# Altium project Front_LED_Module.PrjPcb
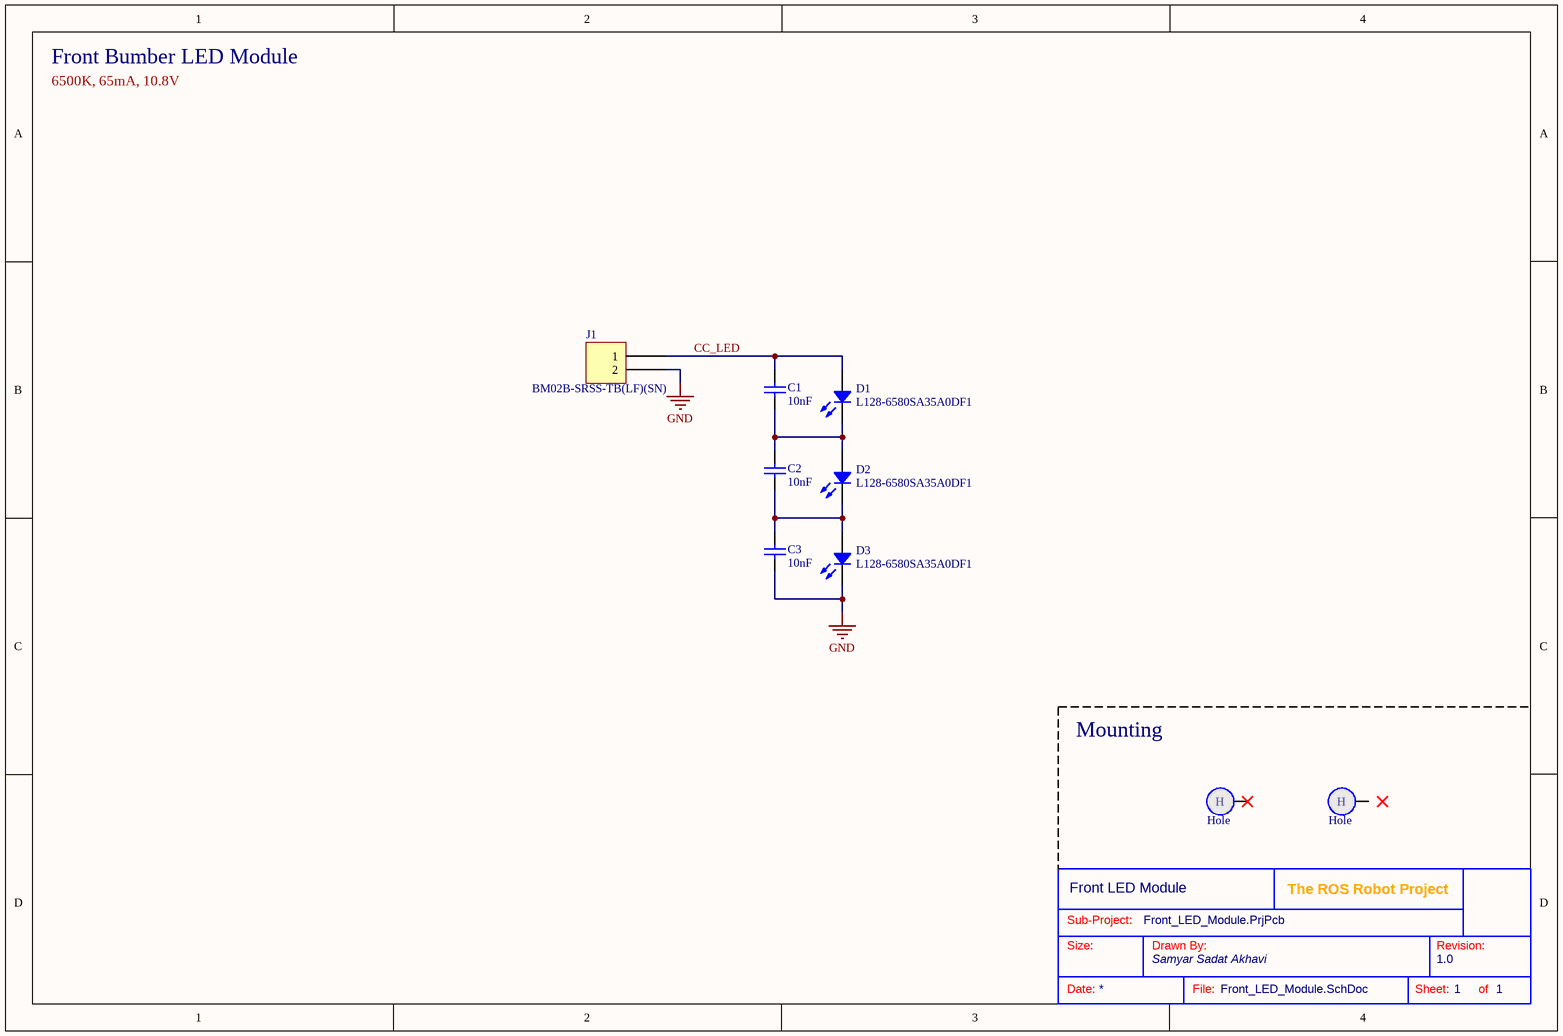
[diagram p0: Front_LED_Module.SchDoc]
MainProjectName: The ROS Robot Project
1 sheet, 10 parts. Net scope: global (net labels, ports and power ports of the same name join across sheets).
Board file: Front_LED_Module.PcbDoc

## Sheet Front_LED_Module.SchDoc: Front LED Module
size A4; DrawnBy: Samyar Sadat Akhavi; Revision: 1.0; SheetNumber: 1; SheetTotal: 1

### Parts
?  (no value)  (graphical)
C1  10nF  [CAP_SMD_603]
C2  10nF  [CAP_SMD_603]
C3  10nF  [CAP_SMD_603]
D1  L128-6580SA35A0DF1  [CREE J 2835]
D2  L128-6580SA35A0DF1  [CREE J 2835]
D3  L128-6580SA35A0DF1  [CREE J 2835]
Hole1  Hole  [Hole_2mm]  (no BOM)
Hole2  Hole  [Hole_2mm]  (no BOM)
J1  BM02B-SRSS-TB(LF)(SN)  [JST BM02B-SRSS-TB]

### Nets
GND: C3.2 D3.2 J1.2
CC_LED: C1.1 D1.1 J1.1
NetC1_2: C1.2 C2.1 D1.2 D2.1
NetC2_2: C2.2 C3.1 D2.2 D3.1

Not connected (* = marked no-connect by the designer): Hole1 1*; Hole2 1

### Notes on the sheet
- Front Bumber LED Module
- 6500K, 65mA, 10.8V
- Mounting
- Sub-Project:
- Size:
- Drawn By:
- Revision:
- Date:
- File:
- Sheet:
- of
- (in symbol Hole) H

### Library data of the parts
? = Standard Title Block
C1-C3 = Non-polar Capacitor: Generic Ceramic Capacitor; Voltage: 16V; Value: 10nF
D1-D3 = JE2835AWT-R-H40GA0000-N0000001: LED COOL WHITE 6500K LUXEON 2835 2.7V; Part Number: L128-6580SA35A0DF1
J1 = BM02B-SRSS-TB(LF)(SN): CONN HEADER SMD 2POS 1MM; Manufacturer: JST Sales America Inc.; Current Rating (Amps): 0.7A; Material Flammability Rating: UL94 V-0; Number of Positions: 2; Number of Positions Loaded: All; Pitch - Mating: 0.039" (1.00mm); Shrouding: Shrouded - 4 Wall; Style: Board to Cable/Wire; Voltage Rating: 50V; Part Number: BM02B-SRSS-TB(LF)(SN); ComponentLink1Description: Datasheet; ComponentLink1URL: http://www.jst-mfg.com/product/pdf/eng/eSR.pdf; ComponentLink2Description: DigiKey Link; ComponentLink2URL: http://digikey.com/product-detail/en/jst-sales-america-inc/BM02B-SRSS-TB-LF-SN/455-1788-1-ND/926859; Connector Type: Header; Contact Finish - Mating: Tin; Contact Finish - Post: Tin; Contact Material: Copper Alloy; Contact Shape: Square; Contact Type: Male Pin; Fastening Type: Push-Pull; Features: Solder Retention; Insulation Color: Natural; Insulation Height: 0.167" (4.25mm); Insulation Material: Polyamide (PA), Nylon; LastUpdated: 1/12/2020 10:11:04 PM; Lifecycle Status: Active; Minimum Order: 1; Mounting Type: Surface Mount; Number of Rows: 1; Operating Temperature: -25°C ~ 85°C; Packaging: TapeAndReel; PartId: 12; Part Status: Active; Price: 0.22; Series: SR; Supplier 1: DigiKey; Supplier Part Number 1: 455-1788-1-ND; Termination: Solder